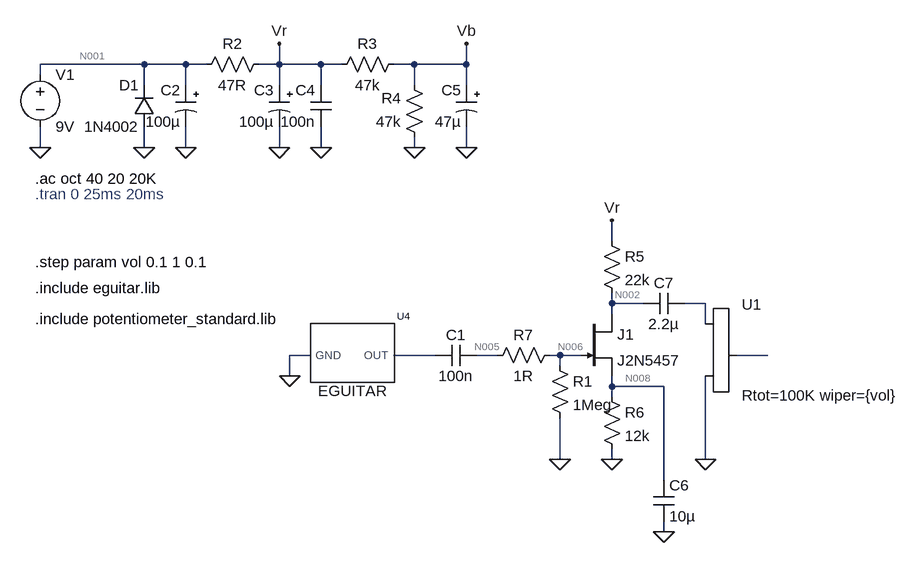
[diagram p0: schematic output.asc]
output.asc, the LTspice schematic file:
Version 4
SHEET 1 1728 792
WIRE -560 -304 -720 -304
WIRE -496 -304 -560 -304
WIRE -464 -304 -496 -304
WIRE -352 -304 -352 -336
WIRE -352 -304 -384 -304
WIRE -288 -304 -352 -304
WIRE -256 -304 -288 -304
WIRE -144 -304 -176 -304
WIRE -64 -304 -64 -336
WIRE -64 -304 -144 -304
WIRE -720 -288 -720 -304
WIRE -560 -272 -560 -304
WIRE -496 -272 -496 -304
WIRE -352 -272 -352 -304
WIRE -288 -272 -288 -304
WIRE -144 -272 -144 -304
WIRE -64 -272 -64 -304
WIRE -720 -176 -720 -208
WIRE -560 -176 -560 -208
WIRE -496 -176 -496 -208
WIRE -352 -176 -352 -208
WIRE -288 -176 -288 -208
WIRE -144 -176 -144 -192
WIRE -64 -176 -64 -208
WIRE 160 -32 160 -64
WIRE 160 64 160 48
WIRE 208 64 160 64
WIRE 304 64 272 64
WIRE 160 80 160 64
WIRE 304 96 304 64
WIRE -304 144 -336 144
WIRE -112 144 -176 144
WIRE -16 144 -48 144
WIRE 80 144 64 144
WIRE 112 144 80 144
WIRE 400 144 352 144
WIRE 80 160 80 144
WIRE -336 176 -336 144
WIRE 160 192 160 176
WIRE 240 192 160 192
WIRE 160 208 160 192
WIRE 80 304 80 240
WIRE 160 304 160 288
WIRE 304 304 304 176
WIRE 240 336 240 192
WIRE 240 416 240 400
FLAG -336 176 0
FLAG -560 -176 0
FLAG -496 -176 0
FLAG -352 -176 0
FLAG -288 -176 0
FLAG -144 -176 0
FLAG -64 -176 0
FLAG -352 -336 Vr
FLAG -64 -336 Vb
FLAG -720 -176 0
FLAG 80 304 0
FLAG 160 304 0
FLAG 304 304 0
FLAG 160 -64 Vr
FLAG 240 416 0
SYMBOL eguitar -208 160 R0
SYMATTR InstName U4
SYMBOL res -368 -320 R90
WINDOW 0 0 56 VBottom 2
WINDOW 3 32 56 VTop 2
SYMATTR InstName R2
SYMATTR Value 47R
SYMATTR SpiceLine tol=1% pwr=0.25
SYMBOL polcap -480 -272 M0
SYMATTR InstName C2
SYMATTR Value 100µ
SYMATTR Description Capacitor
SYMATTR Type cap
SYMATTR SpiceLine V=16 Irms=170m Rser=1 Lser=0 mfg="Nichicon" pn="UPG1C101MPH" type="Al electrolytic"
SYMBOL diode -544 -208 R180
WINDOW 0 24 64 Left 2
WINDOW 3 24 0 Left 2
SYMATTR InstName D1
SYMATTR Value 1N4002
SYMBOL cap -272 -208 R180
WINDOW 0 24 56 Left 2
WINDOW 3 24 8 Left 2
SYMATTR InstName C4
SYMATTR Value 100n
SYMATTR SpiceLine V=50 Irms=728m Rser=0.14361 Lser=0 mfg="KEMET" pn="C0603C104K5RAC" type="X7R"
SYMBOL res -160 -320 R90
WINDOW 0 0 56 VBottom 2
WINDOW 3 32 56 VTop 2
SYMATTR InstName R3
SYMATTR Value 47k
SYMATTR SpiceLine tol=1% pwr=0.25
SYMBOL res -128 -176 R180
WINDOW 0 36 76 Left 2
WINDOW 3 36 40 Left 2
SYMATTR InstName R4
SYMATTR Value 47k
SYMATTR SpiceLine tol=1% pwr=0.25
SYMBOL polcap -48 -272 M0
WINDOW 3 24 56 Left 2
SYMATTR Value 47µ
SYMATTR InstName C5
SYMATTR Description Capacitor
SYMATTR Type cap
SYMATTR SpiceLine V=25 Irms=170m Rser=1 Lser=0 mfg="Nichicon" pn="UPG1E470MPH" type="Al electrolytic"
SYMBOL polcap -336 -272 M0
SYMATTR InstName C3
SYMATTR Value 100µ
SYMATTR Description Capacitor
SYMATTR Type cap
SYMATTR SpiceLine V=16 Irms=170m Rser=1 Lser=0 mfg="Nichicon" pn="UPG1C101MPH" type="Al electrolytic"
SYMBOL voltage -720 -304 R0
WINDOW 123 0 0 Left 0
WINDOW 39 0 0 Left 0
SYMATTR InstName V1
SYMATTR Value 9V
SYMBOL cap -48 128 R90
WINDOW 0 0 32 VBottom 2
WINDOW 3 32 32 VTop 2
SYMATTR InstName C1
SYMATTR Value 100n
SYMBOL res 64 144 R0
SYMATTR InstName R1
SYMATTR Value 1Meg
SYMBOL njf 112 80 R0
SYMATTR InstName J1
SYMATTR Value J2N5457
SYMBOL res 144 -48 R0
SYMATTR InstName R5
SYMATTR Value 22k
SYMBOL res 144 192 R0
SYMATTR InstName R6
SYMATTR Value 12k
SYMBOL cap 224 336 R0
SYMATTR InstName C6
SYMATTR Value 10µ
SYMBOL cap 272 48 R90
WINDOW 0 0 32 VBottom 2
WINDOW 3 32 32 VTop 2
SYMATTR InstName C7
SYMATTR Value 2.2µ
SYMBOL potentiometer_standard 288 80 R0
SYMATTR InstName U1
SYMATTR Value Rtot=100K wiper={vol}
SYMBOL res 80 128 R90
WINDOW 0 0 56 VBottom 2
WINDOW 3 32 56 VTop 2
SYMATTR InstName R7
SYMATTR Value 1R
TEXT -728 -104 Left 2 ;.tran 0 25ms 20ms
TEXT -728 40 Left 2 !.include eguitar.lib
TEXT -728 88 Left 2 !.include potentiometer_standard.lib
TEXT -728 0 Left 2 !.step param vol 0.1 1 0.1
TEXT -728 -128 Left 2 !.ac oct 40 20 20K

The netlist it stands for:
* output.asc
XU4 N004 0 EGUITAR  ; pins OUT GND
R2 Vr N001 47R tol=1% pwr=0.25
C2 N001 0 100µ V=16 Irms=170m Rser=1 Lser=0 mfg="Nichicon" pn="UPG1C101MPH" type="Al electrolytic"
D1 0 N001 1N4002
C4 0 Vr 100n V=50 Irms=728m Rser=0.14361 Lser=0 mfg="KEMET" pn="C0603C104K5RAC" type="X7R"
R3 Vb Vr 47k tol=1% pwr=0.25
R4 0 Vb 47k tol=1% pwr=0.25
C5 Vb 0 47µ V=25 Irms=170m Rser=1 Lser=0 mfg="Nichicon" pn="UPG1E470MPH" type="Al electrolytic"
C3 Vr 0 100µ V=16 Irms=170m Rser=1 Lser=0 mfg="Nichicon" pn="UPG1C101MPH" type="Al electrolytic"
V1 N001 0 9V
C1 N005 N004 100n
R1 N006 0 1Meg
J1 N002 N006 N008 J2N5457
R5 Vr N002 22k
R6 N008 0 12k
C6 N008 0 10µ
C7 N003 N002 2.2µ
XU1 N003 0 N007 Rtot=100K wiper={vol}
R7 N006 N005 1R
.model D D
.lib standard.dio
.model NJF NJF
.model PJF PJF
.lib standard.jft
* .tran 0 25ms 20ms
.include eguitar.lib
.include potentiometer_standard.lib
.step param vol 0.1 1 0.1
.ac oct 40 20 20K
.lib eguitar.lib
.backanno
.end

* Results of the author's LTspice run, read from the files saved beside the schematic
* Operating Point (first step), zero values left out:
*   vol = 100 m
*   V(vr) = 8.991 V
*   V(n001) = 9 V
*   V(vb) = 4.496 V
*   V(n005) = 15.01 µV
*   V(n006) = 15.01 µV
*   V(n002) = 6.993 V
*   V(n008) = 1.09 V
*   I(D1) = -14.36 nA
*   Id(J1) = 90.81 µA
*   Ig(J1) = -15.01 pA
*   Is(J1) = -90.81 µA
*   I(R6) = 90.81 µA
*   I(R5) = 90.81 µA
*   I(R1) = 15.01 pA
*   I(R4) = -95.65 µA
*   I(R3) = -95.65 µA
*   I(R2) = -186.5 µA
*   I(V1) = -186.5 µA
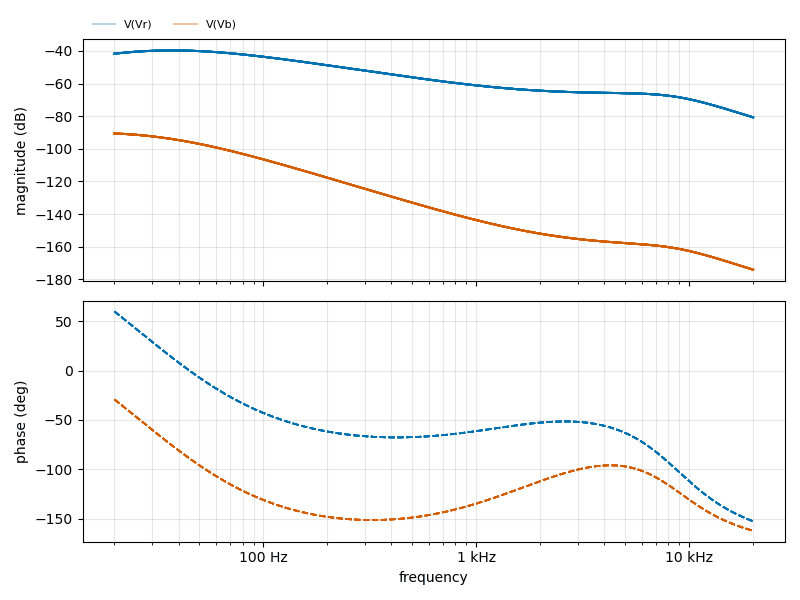
[diagram p1: AC Analysis of output.asc, plotted from the saved traces]
* AC Analysis, 10 runs:
*   V(Vr) [run 1]: -41.73 dB at 20 Hz, -80.72 dB at 20 kHz, peak -39.73 dB at 37.32 Hz, 3 dB below the peak at 87.34 Hz
*   V(Vr) [run 2]: -41.73 dB at 20 Hz, -80.72 dB at 20 kHz, peak -39.73 dB at 37.32 Hz, 3 dB below the peak at 87.34 Hz
*   V(Vr) [run 3]: -41.73 dB at 20 Hz, -80.72 dB at 20 kHz, peak -39.73 dB at 37.32 Hz, 3 dB below the peak at 87.34 Hz
*   V(Vr) [run 4]: -41.73 dB at 20 Hz, -80.72 dB at 20 kHz, peak -39.73 dB at 37.32 Hz, 3 dB below the peak at 87.34 Hz
*   V(Vr) [run 5]: -41.73 dB at 20 Hz, -80.72 dB at 20 kHz, peak -39.73 dB at 37.32 Hz, 3 dB below the peak at 87.34 Hz
*   V(Vr) [run 6]: -41.73 dB at 20 Hz, -80.72 dB at 20 kHz, peak -39.73 dB at 37.32 Hz, 3 dB below the peak at 87.34 Hz
*   V(Vr) [run 7]: -41.73 dB at 20 Hz, -80.72 dB at 20 kHz, peak -39.73 dB at 37.32 Hz, 3 dB below the peak at 87.34 Hz
*   V(Vr) [run 8]: -41.73 dB at 20 Hz, -80.72 dB at 20 kHz, peak -39.73 dB at 37.32 Hz, 3 dB below the peak at 87.34 Hz
*   V(Vb) [run 1]: -90.59 dB at 20 Hz, -174.04 dB at 20 kHz, peak -90.59 dB at 20 Hz, 3 dB below the peak at 35.55 Hz
*   V(Vb) [run 2]: -90.59 dB at 20 Hz, -174.04 dB at 20 kHz, peak -90.59 dB at 20 Hz, 3 dB below the peak at 35.55 Hz
*   V(Vb) [run 3]: -90.59 dB at 20 Hz, -174.04 dB at 20 kHz, peak -90.59 dB at 20 Hz, 3 dB below the peak at 35.55 Hz
*   V(Vb) [run 4]: -90.59 dB at 20 Hz, -174.04 dB at 20 kHz, peak -90.59 dB at 20 Hz, 3 dB below the peak at 35.55 Hz
*   V(Vb) [run 5]: -90.59 dB at 20 Hz, -174.04 dB at 20 kHz, peak -90.59 dB at 20 Hz, 3 dB below the peak at 35.55 Hz
*   V(Vb) [run 6]: -90.59 dB at 20 Hz, -174.04 dB at 20 kHz, peak -90.59 dB at 20 Hz, 3 dB below the peak at 35.55 Hz
*   V(Vb) [run 7]: -90.59 dB at 20 Hz, -174.04 dB at 20 kHz, peak -90.59 dB at 20 Hz, 3 dB below the peak at 35.55 Hz
*   V(Vb) [run 8]: -90.59 dB at 20 Hz, -174.04 dB at 20 kHz, peak -90.59 dB at 20 Hz, 3 dB below the peak at 35.55 Hz